# Altium project Audio Amplifier.PrjPCB
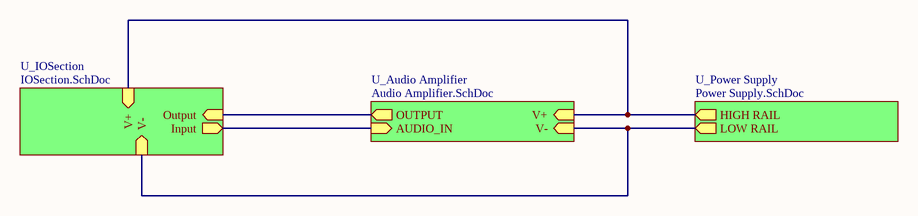
[diagram p0: Master Sheet.SchDoc]
4 sheets, 76 parts. Net scope: hierarchical (ports join the sheet entries above them; power ports are global).
Board file: Audio Amplifier.PcbDoc
Sheets:
  Master Sheet.SchDoc
    U_Audio Amplifier = Audio Amplifier.SchDoc
    U_Power Supply = Power Supply.SchDoc
    U_IOSection = IOSection.SchDoc

## Sheet Master Sheet.SchDoc
size A

### Sub-sheets
U_Audio Amplifier = Audio Amplifier.SchDoc: V+ (in), V- (in), AUDIO_IN (in), OUTPUT (out)
U_IOSection = IOSection.SchDoc: Output (in), Input (out), V+ (in), V- (in)
U_Power Supply = Power Supply.SchDoc: HIGH RAIL (out), LOW RAIL (out)

### Nets
AUDIO_IN: sheet U_Audio Amplifier/AUDIO_IN, sheet U_IOSection/Input
NEG: sheet U_Audio Amplifier/V-, sheet U_Power Supply/LOW RAIL, sheet U_IOSection/V-
OUTPUT: sheet U_Audio Amplifier/OUTPUT, sheet U_IOSection/Output
POS: sheet U_Audio Amplifier/V+, sheet U_Power Supply/HIGH RAIL, sheet U_IOSection/V+

## Sheet Audio Amplifier.SchDoc
size A
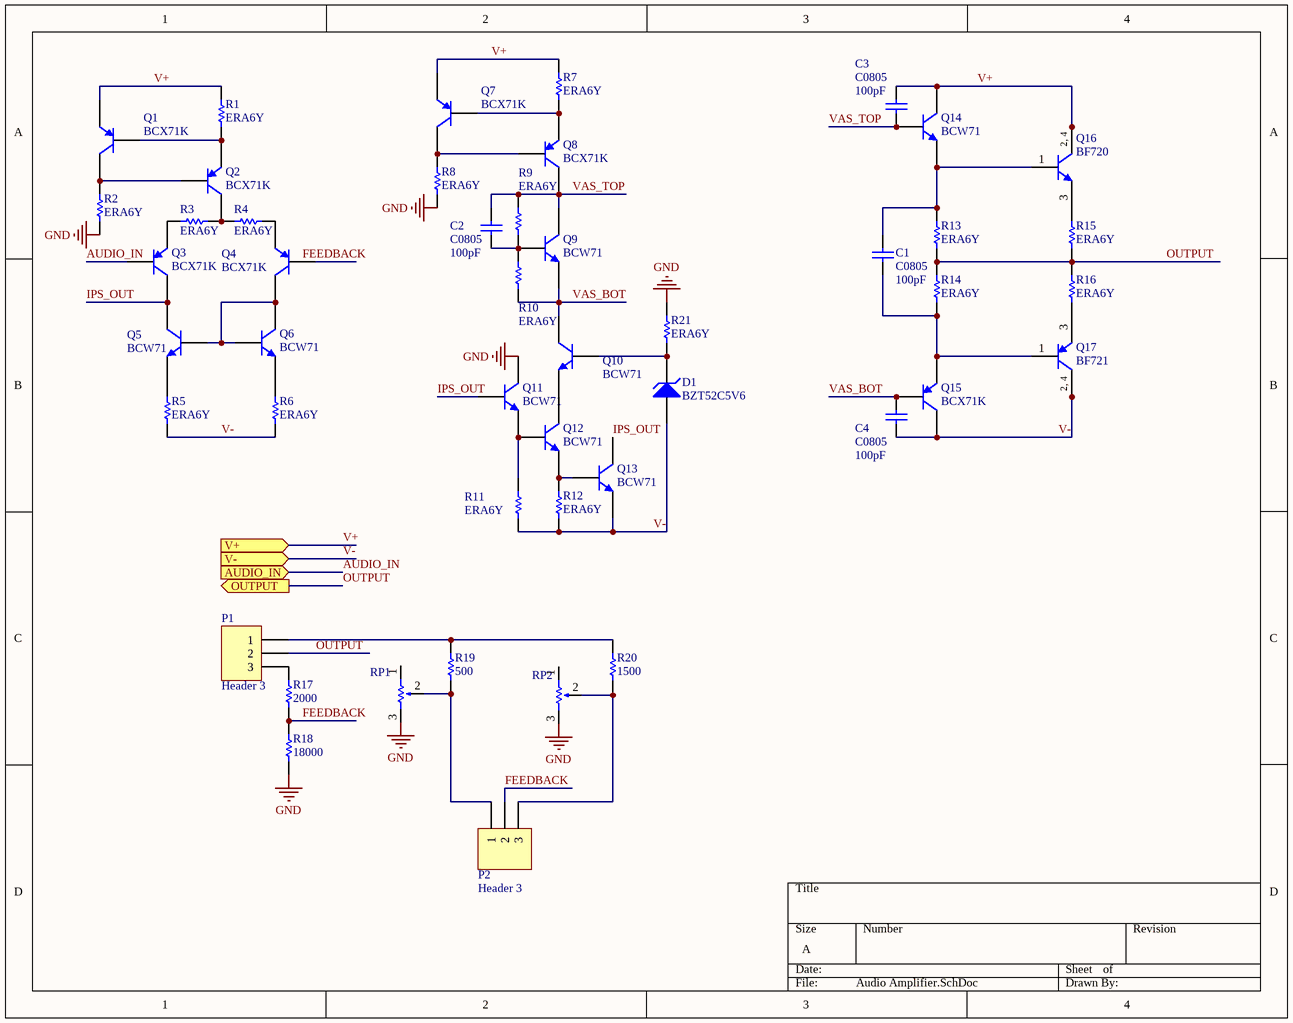
[diagram p1: Audio Amplifier.SchDoc]

### Parts
C1  C0805  value 100pF  [0805]
C2  C0805  value 100pF  [0805]
C3  C0805  value 100pF  [0805]
C4  C0805  value 100pF  [0805]
D1  BZT52C5V6  [SOD-123]
P1  Header 3  [HDR1X3]
P2  Header 3  [HDR1X3]
Q1  BCX71K  [SOT-23B_N]
Q2  BCX71K  [SOT-23B_N]
Q3  BCX71K  [SOT-23B_N]
Q4  BCX71K  [SOT-23B_N]
Q5  BCW71  [SOT-23B_N]
Q6  BCW71  [SOT-23B_N]
Q7  BCX71K  [SOT-23B_N]
Q8  BCX71K  [SOT-23B_N]
Q9  BCW71  [SOT-23B_N]
Q10  BCW71  [SOT-23B_N]
Q11  BCW71  [SOT-23B_N]
Q12  BCW71  [SOT-23B_N]
Q13  BCW71  [SOT-23B_N]
Q14  BCW71  [SOT-23B_N]
Q15  BCX71K  [SOT-23B_N]
Q16  BF720  [SOT-223]
Q17  BF721  [SOT-223]
R1  ERA6Y  [ERA-0805]
R2  ERA6Y  [ERA-0805]
R3  ERA6Y  [ERA-0805]
R4  ERA6Y  [ERA-0805]
R5  ERA6Y  [ERA-0805]
R6  ERA6Y  [ERA-0805]
R7  ERA6Y  [ERA-0805]
R8  ERA6Y  [ERA-0805]
R9  ERA6Y  [ERA-0805]
R10  ERA6Y  [ERA-0805]
R11  ERA6Y  [ERA-0805]
R12  ERA6Y  [ERA-0805]
R13  ERA6Y  [ERA-0805]
R14  ERA6Y  [ERA-0805]
R15  ERA6Y  [ERA-0805]
R16  ERA6Y  [ERA-0805]
R17  2000  [ERA-0805]
R18  18000  [ERA-0805]
R19  500  [ERA-0805]
R20  1500  [ERA-0805]
R21  ERA6Y  [ERA-0805]
RP1  Panasonic Potentiometer  [Panasonic Potentiometer]  (value not drawn)
RP2  Panasonic Potentiometer  [Panasonic Potentiometer]  (value not drawn)

### Ports
AUDIO_IN (in), OUTPUT (out), V+ (in), V- (in)

### Nets
GND: Q11.3(C) R2.1 R8.1 R18.1 R21.2 RP1.3 RP2.3
AUDIO_IN: Q3.1(B) ; port AUDIO_IN
FEEDBACK: P2.2 R17.1 R18.2
IPS_OUT: Q3.3(C) Q5.3(C) Q11.1(B) Q13.3(C)
OUTPUT: P1.2 R13.1 R14.2 R15.1 R16.2 ; port OUTPUT
V+: C3.2 Q1.2(E) Q7.2(E) Q14.3(C) Q16.2(C) Q16.4(C) R1.2 R7.2 ; port V+  [project net POS]
V-: C4.1 D1.1(A) Q13.2(E) Q15.3(C) Q17.2(C) Q17.4(C) R5.2 R6.2 R11.1 R12.1 ; port V-  [project net NEG]
VAS_BOT: C4.2 Q9.2(E) Q10.3(C) Q15.1(B) R9.1
VAS_TOP: C2.2 C3.1 Q8.3(C) Q9.3(C) Q14.1(B) R10.2
NetC1_1: C1.1 Q15.2(E) Q17.1(B) R14.1
NetC1_2: C1.2 Q14.2(E) Q16.1(B) R13.2
NetC2_1: C2.1 Q9.1(B) R9.2 R10.1
NetD1_2: D1.2(K) Q10.1(B) R21.1
NetP1_1: P1.1 R19.2 R20.2
NetP1_3: P1.3 R17.2
NetP2_1: P2.1 R19.1 RP1.2
NetP2_3: P2.3 R20.1 RP2.2
NetQ1_1: Q1.1(B) Q2.2(E) R1.1
NetQ1_3: Q1.3(C) Q2.1(B) R2.2
NetQ2_3: Q2.3(C) R3.1 R4.2
NetQ3_2: Q3.2(E) R3.2
NetQ4_2: Q4.2(E) R4.1
NetQ4_3: Q4.3(C) Q5.1(B) Q6.1(B) Q6.3(C)
NetQ5_2: Q5.2(E) R5.1
NetQ6_2: Q6.2(E) R6.1
NetQ7_1: Q7.1(B) Q8.2(E) R7.1
NetQ7_3: Q7.3(C) Q8.1(B) R8.2
NetQ10_2: Q10.2(E) Q12.3(C)
NetQ11_2: Q11.2(E) Q12.1(B) R11.2
NetQ12_2: Q12.2(E) Q13.1(B) R12.2
NetQ16_3: Q16.3(E) R15.2
NetQ17_3: Q17.3(E) R16.1

Not connected (* = marked no-connect by the designer): Q4 1(B); RP1 1; RP2 1

### Notes on the sheet
- Labels drawn without touching a wire or pin: FEEDBACK
- (in symbol BF720) 2, 4
- (in symbol BF721) 2, 4

### Library data of the parts
C1-C4 = C0805: Ceramic Chip Capacitor - Standard; Note: Footprint corresponds to dimensions for bulk cassette packaging. This case size has tightened tolerances.; Published: 17-Jul-2002; LatestRevisionDate: 19-Mar-2004; LatestRevisionNote: Silkscreen size reduced.; DatasheetDocument: Mar-2001; PackageDocument: Mar-2001; PackageReference: 0805; Publisher: Altium Limited; Code_JEITA: 0805; Code_IPC: 2012[0805]; ComponentLink1Description: Manufacturer Link; ComponentLink1URL: http://www.kemet.com/; ComponentLink2Description: Datasheet; ComponentLink2URL: http://www.kemet.com/kemet/web/homepage/kechome.nsf/vapubfilesname/F3102TA.pdf/$file/F3102TA.pdf
D1 = BZT52C5V6: Surface Mount Zener Diode; Published: 8-Jun-2000; LatestRevisionDate: 17-Jul-2002; LatestRevisionNote: Re-released for DXP Platform.; DatasheetDocument: REV. L-2; PackageReference: SOD-123; Publisher: Altium Limited; ComponentLink1Description: Manufacturer Link; ComponentLink1URL: http://www.vishay.com/
P1 P2 = Header 3: Header, 3-Pin; LatestRevisionDate: 17-Jul-2002; LatestRevisionNote: Re-released for DXP Platform.; Publisher: Altium Limited
Q1-Q4 Q7 Q8 Q15 = BCX71K: PNP Epitaxial Silicon Transistor; Published: 8-Jun-2000; LatestRevisionDate: 20-Nov-2009; LatestRevisionNote: IPC-7351 Footprint Added.; DatasheetVersion: 1999; PackageVersion: Aug-1999; PackageReference: SOT-23B; Publisher: Altium Limited; PackageDescription: 3-Pin SOT-23 Package 0.95 mm Pitch, 2.4 mm Lead Span; ComponentLink1Description: Manufacturer Link; ComponentLink1URL: http://www.fairchildsemi.com/; ComponentLink2Description: Datasheet; ComponentLink2URL: http://www.fairchildsemi.com/ds/BC%2FBCX71K.pdf
Q5 Q6 Q9-Q14 = BCW71: NPN Epitaxial Silicon Transistor; Published: 8-Jun-2000; LatestRevisionDate: 20-Nov-2009; LatestRevisionNote: IPC-7351 Footprint Added.; DatasheetVersion: 1999; PackageVersion: Aug-1999; PackageReference: SOT-23B; Publisher: Altium Limited; PackageDescription: 3-Pin SOT-23 Package 0.95 mm Pitch, 2.4 mm Lead Span; ComponentLink1Description: Manufacturer Link; ComponentLink1URL: http://www.fairchildsemi.com/; ComponentLink2Description: Datasheet; ComponentLink2URL: http://www.fairchildsemi.com/ds/BC%2FBCW71.pdf
Q16 = BF720: NPN Silicon High-Voltage Transistor; Published: 8-Jun-2000; DatasheetDocument: May-1991; PackageDocument: Sep-2000; PackageReference: SOT-223; Publisher: Altium Limited; ComponentLink1Description: Manufacturer Link; ComponentLink1URL: http://www.infineon.com/; ComponentLink2Description: Datasheet; ComponentLink2URL: http://www.infineon.convergy.de/upload/documents/techdoc/GF_32/bf720.pdf
Q17 = BF721: PNP Silicon High-Voltage Transistor; Published: 8-Jun-2000; DatasheetDocument: Jul-1994; PackageDocument: Sep-2000; PackageReference: SOT-223; Publisher: Altium Limited; ComponentLink1Description: Manufacturer Link; ComponentLink1URL: http://www.infineon.com/; ComponentLink2Description: Datasheet; ComponentLink2URL: http://www.infineon.convergy.de/upload/documents/techdoc/GF_32/bf721.pdf
R1-R21 = ERA6Y: Rectangular Thick Film Chip Resistor, 10 Ohm to 1M Ohm Range, 0.1% and 0.5% Tolerance, 0805 Size, 0.1 W; Note: If flow soldering, adjust pad width of PCB Footprint to 0.7 - 0.8 times the width of the resistor.; Published: 17-Dec-2003; LatestRevisionDate: 19-Mar-2004; LatestRevisionNote: Silkscreen size reduced.; PackageDocument: Mar-2003; PackageReference: ERA-0805; Publisher: Altium Limited; Code_IPC: 2012 [0805]; ComponentLink1Description: Manufacturer Link; ComponentLink1URL: http://www.panasonic.com/industrial/components/resistive_products.htm; ComponentLink2Description: Datasheet; ComponentLink2URL: http://www.panasonic.com/industrial/components/pdf/AOA0000CE8.pdf

## Sheet Power Supply.SchDoc
size A
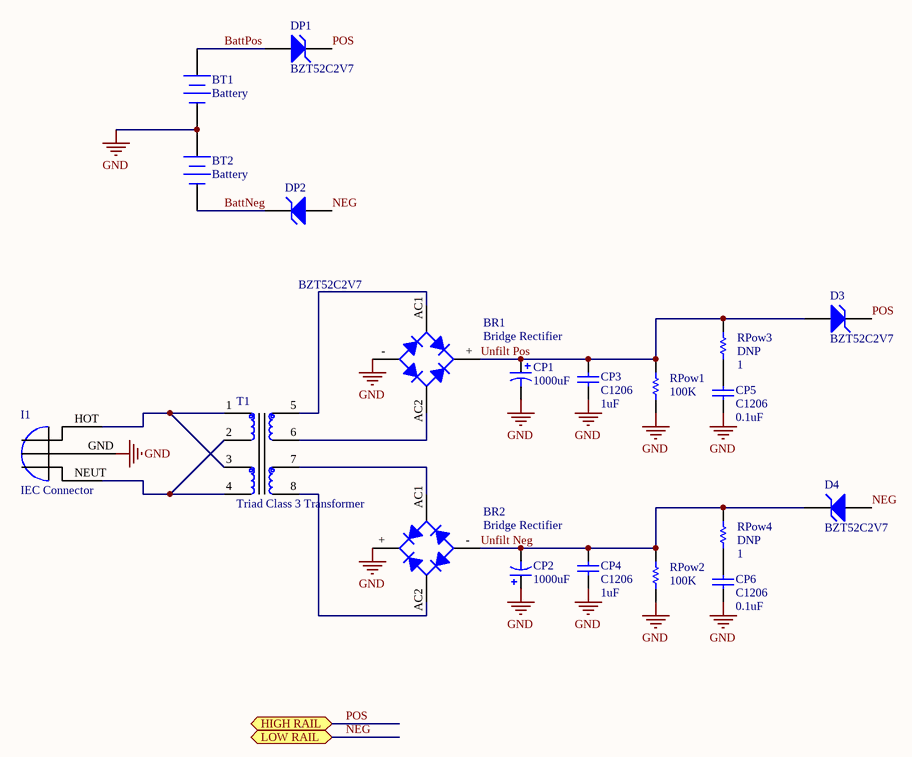
[diagram p2: Power Supply.SchDoc]

### Parts
BR1  Bridge Rectifier  [Bridge Rectifier]
BR2  Bridge Rectifier  [Bridge Rectifier]
BT1  Battery  [BAT-2]
BT2  Battery  [BAT-2]
CP1  1000uF  [CAPPR7.5-16X25]
CP2  1000uF  [CAPPR7.5-16X25]
CP3  C1206  value 1uF  [1206]
CP4  C1206  value 1uF  [1206]
CP5  C1206  value 0.1uF  [1206]
CP6  C1206  value 0.1uF  [1206]
D3  BZT52C2V7  [SOD-123]
D4  BZT52C2V7  [SOD-123]
DP1  BZT52C2V7  [SOD-123]
DP2  BZT52C2V7  [SOD-123]
I1  IEC Connector  [IEC Connector]
RPow1  100K  [ERA-0805]
RPow2  100K  [ERA-0805]
RPow3  DNP  value 1  [ERA-0805]
RPow4  DNP  value 1  [ERA-0805]
T1  Triad Class 3 Transformer  [TRIAD CLASS 3 TRANSFORMER]

### Ports
HIGH RAIL, LOW RAIL

### Nets
GND: BR1.- BR2.+ BT1.2(-) BT2.1(+) CP1.2 CP2.1 CP3.1 CP4.1 CP5.1 CP6.1 I1.GND RPow1.1 RPow2.1
BattNeg: BT2.2(-) DP2.2(K)
BattPos: BT1.1(+) DP1.1(A)
NEG: D4.1(A) DP2.1(A) ; port LOW RAIL
POS: D3.2(K) DP1.2(K) ; port HIGH RAIL
Unfilt Neg: BR2.- CP2.2 CP4.2 D4.2(K) RPow2.2 RPow4.2
Unfilt Pos: BR1.+ CP1.1 CP3.2 D3.1(A) RPow1.2 RPow3.2
NetBR1_AC1: BR1.AC1 T1.5
NetBR1_AC2: BR1.AC2 T1.6
NetBR2_AC1: BR2.AC1 T1.7
NetBR2_AC2: BR2.AC2 T1.8
NetCP5_2: CP5.2 RPow3.1
NetCP6_2: CP6.2 RPow4.1
NetI1_HOT: I1.HOT T1.1 T1.3
NetI1_NEUT: I1.NEUT T1.2 T1.4

### Library data of the parts
BT1 BT2 = Battery: Multicell Battery; Published: 24-Mar-1999; LatestRevisionDate: 17-Jul-2002; LatestRevisionNote: Re-released for DXP Platform.; PackageReference: BAT-2; Publisher: Altium Limited; PackageDescription: Battery; 2 Leads
CP1 CP2 = EKA00JG247O00: Aluminum Electrolytic Capacitor, Radial Style with Long Leads: 47uF, 350V; Note: Refer to Manufacturer's Data Sheets for other lead formations; DrillSize: Nominal, Rounded To The Nearest 0.1mm; Published: 19-Mar-2004; DatasheetDocument: 20-Feb-2001; PackageReference: CAPPR7.5-16X25; Publisher: Altium Limited; ComponentLink1Description: Manufacturer Link; ComponentLink1URL: http://www.vishay.com/; ComponentLink2Description: Datasheet; ComponentLink2URL: http://www.vishay.com/docs/25014/eka.pdf; Value: 1000uF
CP3-CP6 = C1206: Ceramic Chip Capacitor - Standard; Published: 17-Jul-2002; LatestRevisionDate: 19-Mar-2004; LatestRevisionNote: Silkscreen size reduced.; DatasheetDocument: Mar-2001; PackageDocument: Mar-2001; PackageReference: 1206; Publisher: Altium Limited; Code_JEITA: 1206; Code_IPC: 3216 [1206]; ComponentLink1Description: Manufacturer Link; ComponentLink1URL: http://www.kemet.com/; ComponentLink2Description: Datasheet; ComponentLink2URL: http://www.kemet.com/kemet/web/homepage/kechome.nsf/vapubfilesname/F3102TA.pdf/$file/F3102TA.pdf
D3 D4 DP1 DP2 = BZT52C2V7: Surface Mount Zener Diode; Published: 8-Jun-2000; LatestRevisionDate: 17-Jul-2002; LatestRevisionNote: Re-released for DXP Platform.; DatasheetDocument: REV. L-2; PackageReference: SOD-123; Publisher: Altium Limited; ComponentLink1Description: Manufacturer Link; ComponentLink1URL: http://www.vishay.com/
RPow1-RPow4 = ERA6Y: as R1 on sheet Audio Amplifier; Published: 17-Dec-2003; LatestRevisionDate: 19-Mar-2004; LatestRevisionNote: Silkscreen size reduced.; PackageDocument: Mar-2003; PackageReference: ERA-0805; Publisher: Altium Limited; Code_IPC: 2012 [0805]; ComponentLink1Description: Manufacturer Link; ComponentLink1URL: http://www.panasonic.com/industrial/components/resistive_products.htm; ComponentLink2Description: Datasheet; ComponentLink2URL: http://www.panasonic.com/industrial/components/pdf/AOA0000CE8.pdf
  RPow1 RPow2: Value: 100K
  RPow3 RPow4: DNP: DNP
BR1 BR2 = Bridge Rectifier: Component Datasheet: http://www.diodes.com/_files/datasheets/ds21225.pdf; Component Link: http://www.digikey.com/product-detail/en/diodes-incorporated/GBU404/GBU404DI-ND/278605
I1 = IEC Connector: Component Datasheet: http://www.qualtekusa.com/Catalog/AC_Receptacles/pdfs/703w0053.pdf; Component Link: http://www.digikey.com/product-detail/en/qualtek/703W-00-53/Q219-ND/245560

## Sheet IOSection.SchDoc
size A
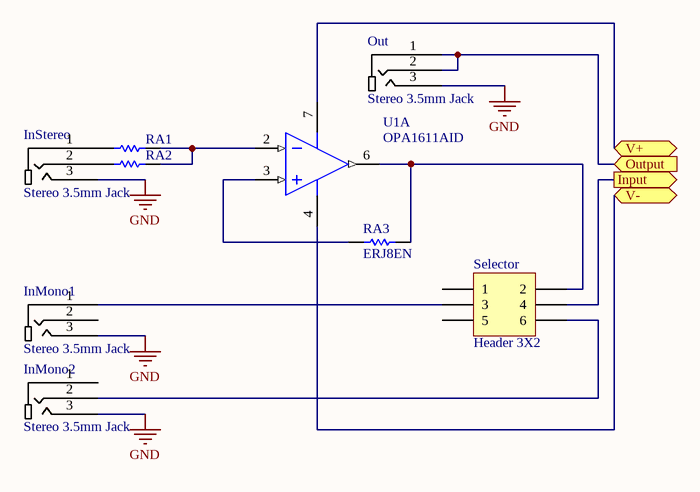
[diagram p3: IOSection.SchDoc]

### Parts
InMono1  Stereo 3.5mm Jack  [3.5mm Audio Jack]
InMono2  Stereo 3.5mm Jack  [3.5mm Audio Jack]
InStereo  Stereo 3.5mm Jack  [3.5mm Audio Jack]
Out  Stereo 3.5mm Jack  [3.5mm Audio Jack]
RA1  ERJ8EN  [8-1206]  (value not drawn)
RA2  ERJ8EN  [8-1206]  (value not drawn)
RA3  ERJ8EN  [8-1206]
Selector  Header 3X2  [HDR2X3]
U1  OPA1611AID  [TI-D8_N]  (part A of 2)

### Ports
Input (out), Output (in), V+, V-

### Nets
GND: InMono1.3 InMono2.3 InStereo.3 Out.3
AUDIO_IN: Selector.4 ; port Input
NEG: U1.4(V-) ; port V-
OUTPUT: Out.1 Out.2 ; port Output
POS: U1.7(V+) ; port V+
NetInMono1_1: InMono1.1 Selector.3
NetInMono2_2: InMono2.2 Selector.6
NetInStereo_1: InStereo.1 RA1.1
NetInStereo_2: InStereo.2 RA2.1
NetRA1_2: RA1.2 RA2.2 U1.2(IN-)
NetRA3_1: RA3.1 U1.3(IN+)
NetRA3_2: RA3.2 Selector.2 U1.6(OUT)

Not connected (* = marked no-connect by the designer): InMono1 2; InMono2 1; Selector 1 5

### Library data of the parts
RA1-RA3 = ERJ8EN: Precision Thick Film Chip Resistor, 10 Ohm to 2.2M Ohm Range, 1% Tolerance, 1206 Size, 0.125 W; Published: 17-Dec-2003; LatestRevisionDate: 19-Mar-2004; LatestRevisionNote: Silkscreen size reduced.; PackageDocument: Mar-2003; PackageReference: 8-1206; Publisher: Altium Limited; Code_IPC: 3216 [1206]; ComponentLink1Description: Manufacturer Link; ComponentLink1URL: http://www.panasonic.com/industrial/components/resistive_products.htm; ComponentLink2Description: Datasheet; ComponentLink2URL: http://www.panasonic.com/industrial/components/pdf/AOA0000CE2.pdf
Selector = Header 3X2: Header, 3-Pin, Dual row; LatestRevisionDate: 17-Jul-2002; LatestRevisionNote: Re-released for DXP Platform.; Publisher: Altium Limited
U1 = OPA1611AID: 1.1 nV/rtHz Noise, Low Power, Precision Operational Amplifier, 4.5 to 36 V, -40 to 85 degC, 8-pin SOIC (D8), Green (RoHS & no Sb/Br); Manufacturer: Texas Instruments; GBW(Typ)(MHz): 40; Iq per channel(Max)(mA): 4.5; Number of Channels: 1; SubFamily: Audio Operational Amplifier; Vmax(V): 36; Vn at Flatband(Typ)(nV/rtHz): 1.1; DatasheetVersion: SBOS450B; PackageVersion: 4040047-3/M, 06/2011; PackageReference: D8; PackageDescription: 8-Pin Plastic Small Outline, Body 4.9 x 3.9 mm, Pitch 1.27 mm; Supplier 1: Digi-Key; Supplier Part Number 1: 296-24958-5-ND; Supplier 2: Farnell; Supplier Part Number 2: 1754264; Supplier 3: Newark; Supplier Part Number 3: 50R7815; Supplier 4: Mouser; Supplier Part Number 4: 595-OPA1611AID; Eco-Plan: Green (RoHS & no Sb/Br); Vmin(V): 4.5; Mounting Technology: Surface Mount; Code_JEDEC: MS-012; PartNumber: OPA1611AID; ComponentLink1Description: Manufacturer URL; ComponentLink1URL: http://www.ti.com/; ComponentLink2Description: Datasheet; ComponentLink2URL: http://www.ti.com/general/docs/lit/getliterature.tsp?genericPartNumber=OPA1611&fileType=pdf; ComponentLink3Description: Package Specification; ComponentLink3URL: http://www.ti.com/litv/pdf/msoi002j

## Nets that join several sheets
GND: Audio Amplifier (7 pins), Power Supply (13 pins), IOSection (InMono1.3 InMono2.3 InStereo.3 Out.3)
AUDIO_IN: Audio Amplifier (Q3.1), IOSection (Selector.4)
NEG: Audio Amplifier (10 pins), Power Supply (D4.1 DP2.1), IOSection (U1.4)
OUTPUT: Audio Amplifier (5 pins), IOSection (Out.1 Out.2)
POS: Audio Amplifier (8 pins), Power Supply (D3.2 DP1.2), IOSection (U1.7)